# EAGLE schematic ts19390-boost-24mm-driver-mk-1 (EAGLE 6.5.0)
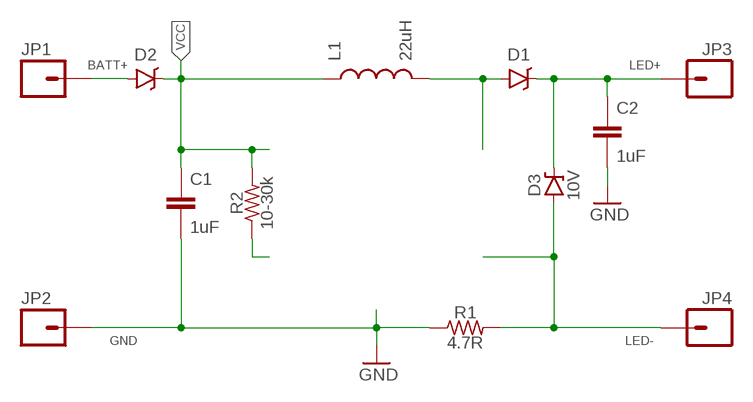
[diagram p0: schematic, sheet 1]

## Parts
C1  1uF  CAPACITOR-CERAMICC0805  [C0805]
C2  1uF  CAPACITOR-CERAMICC0805  [C0805]
D1  B340A  DIODE-SCHOTTKYSOD123  [SOD123-SCHOTTKY]
D2  B340A  DIODE-SCHOTTKYSOD123  [SOD123-SCHOTTKY]
D3  10V  DIODE-ZENERSOD123  [SOD123-ZENER]
JP1  M01PTH  [1X01]
JP2  M01PTH  [1X01]
JP3  M01PTH  [1X01]
JP4  M01PTH  [1X01]
L1  22uH  INDUCTORTAIYO-YUDEN-30XX  [TAIYO-YUDEN-30XX]
R1  4.7R  RESISTORR0805  [R0805]
R2  10-30k  RESISTORR0603  [R0603]

## Nets
BATT+: D2.A JP1.1
GND: C1.2 C2.2 JP2.1 R1.1
LED+: C2.1 D1.C D3.C JP3.1
LED-: D3.A JP4.1 R1.2
N$1: D1.A L1.2
N$2: R2.1
VCC: C1.1 D2.C L1.1 R2.2

## Library data of the parts
C1 C2 = A_butts:CAPACITOR-CERAMIC: CAPACITOR, European symbol
D1 D2 = A_butts:DIODE-SCHOTTKY: Schottky diodes in SFE's production catalog BAT20J 1A 23V 0.62Vf RB751 120mA 40V 0.37Vf PMEG4005EJ 0.5A 40V 0.42Vf MBRA140 1A 40V 0.5Vf B340A 3A 40V SMA
D3 = A_butts:DIODE-ZENER: Zener Diode Production Part - 8199 3.4V Zener Voltage
JP1-JP4 = A_butts:M01: Header 1 Standard 1-pin 0.1" header. Use with straight break away headers (SKU : PRT-00116), right angle break away headers (PRT-00553), swiss pins (PRT-00743), machine pins (PRT-00117), and female headers (PRT-00115).
L1 = A_butts:INDUCTOR: Inductors Basic Inductor/Choke - 0603 and 1206. Footprints are not proven and vary greatly between part numbers. SRN6045- 33uH, 20% 1.4A SDR0403-560KL - 56uH, 10%, 500mA RMS/740mA peak
R1 R2 = A_butts:RESISTOR: RESISTOR, American symbol